# EAGLE design main1 (EAGLE 7.3.0)
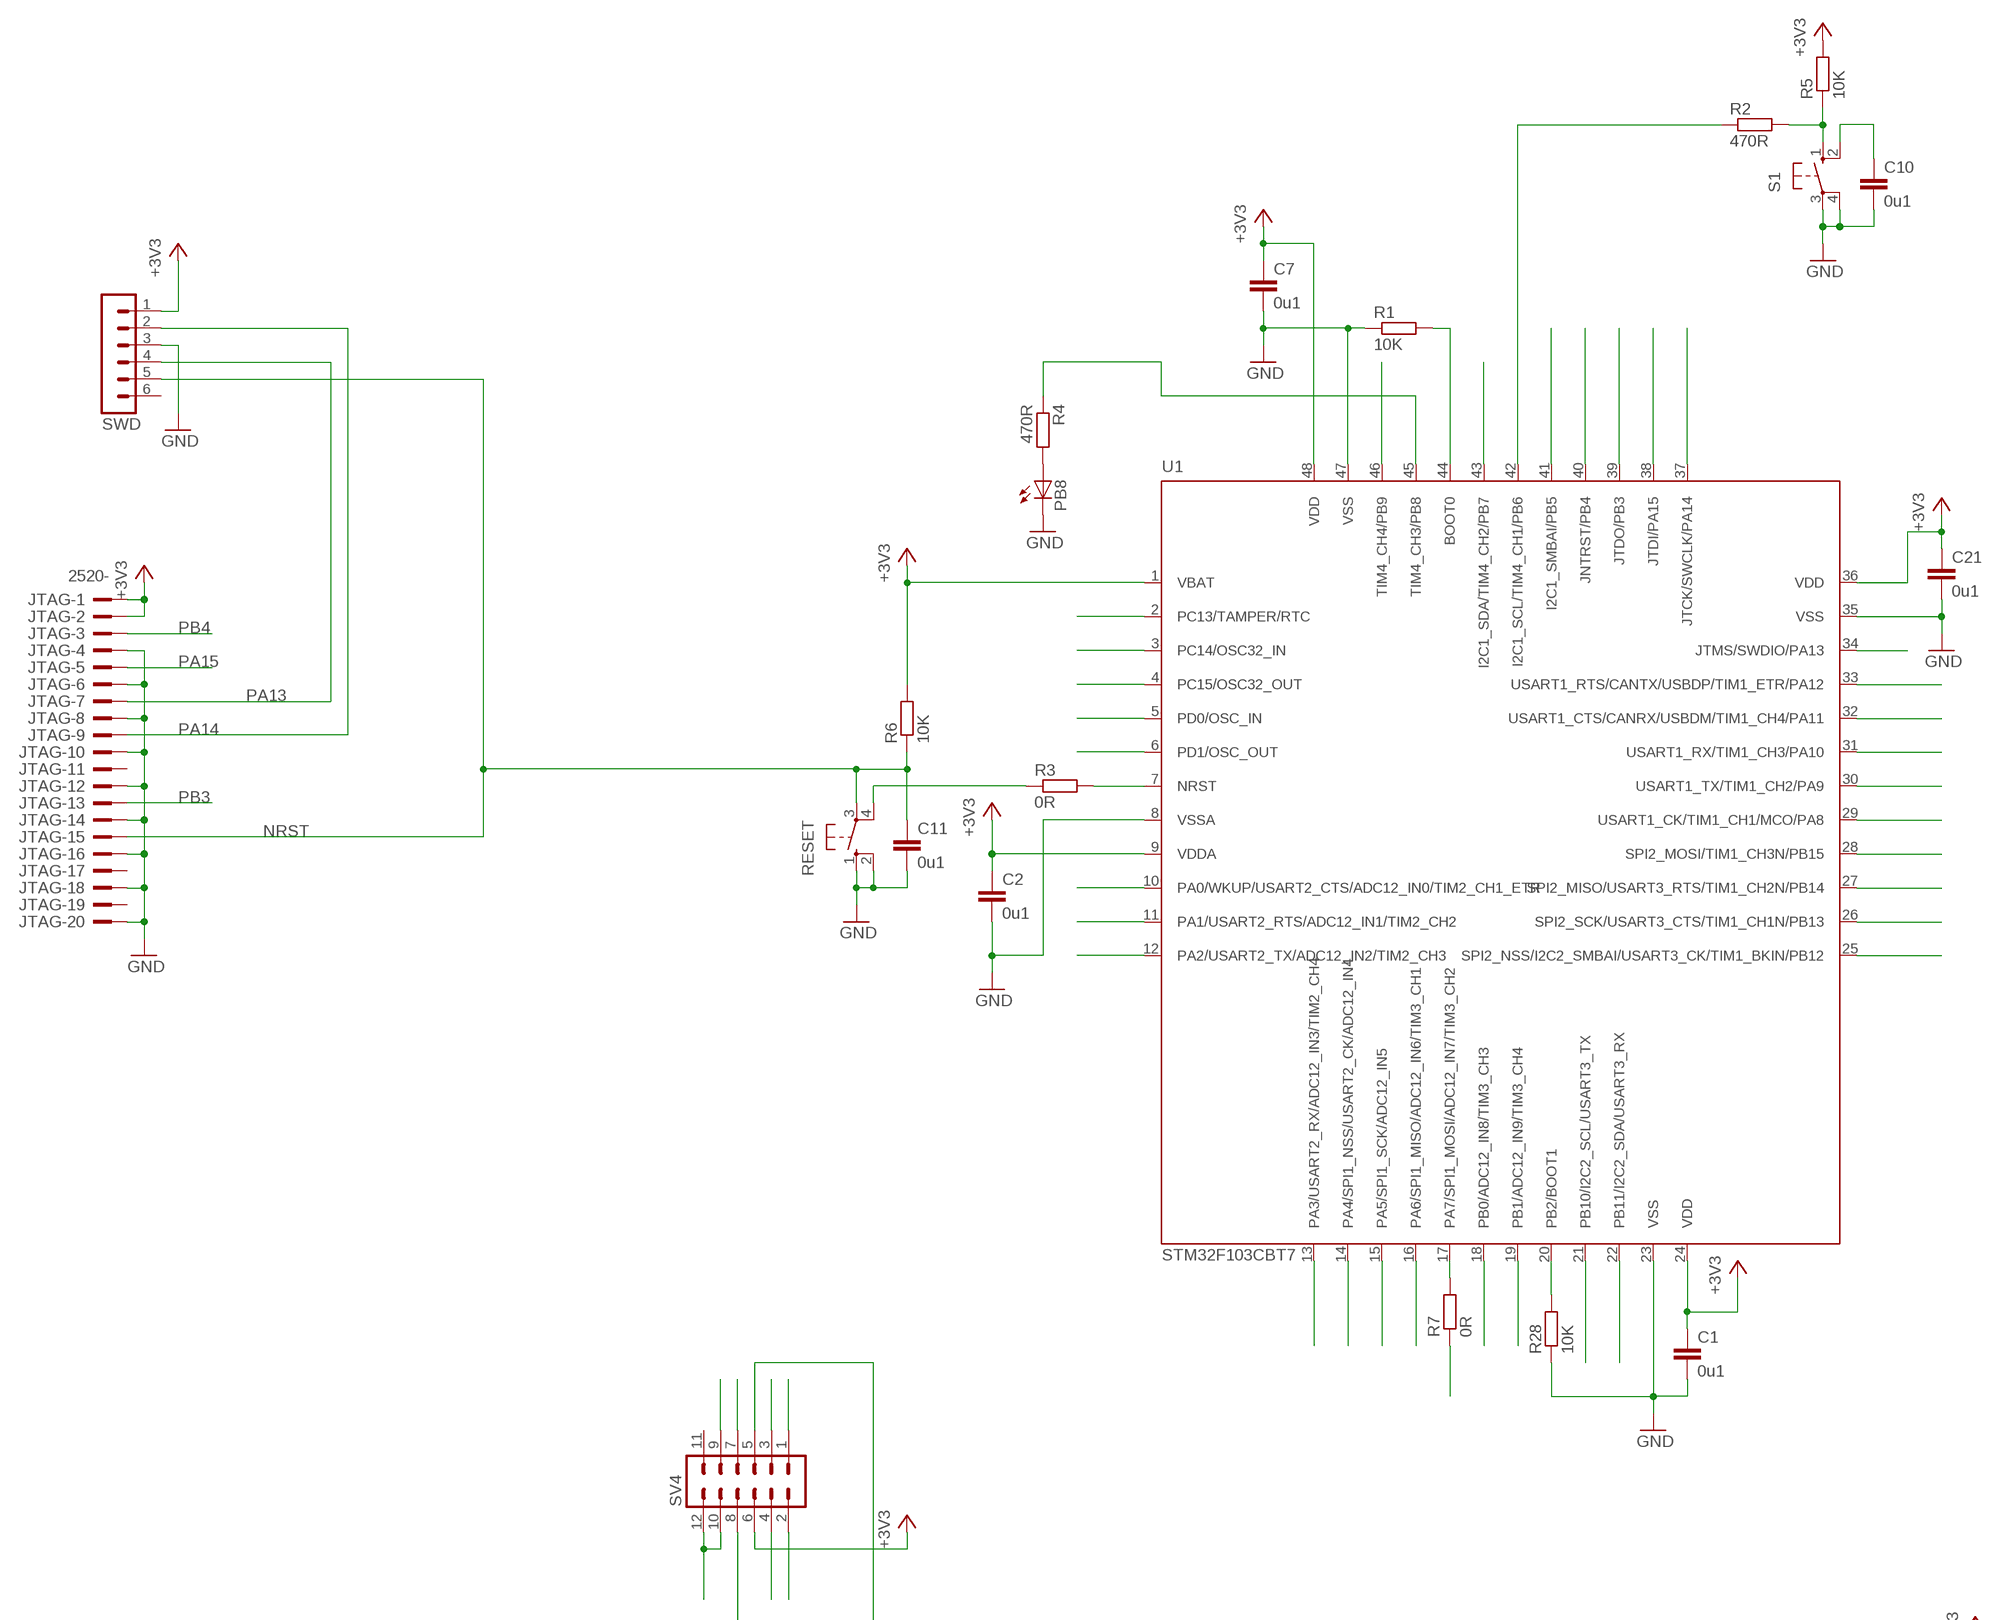
[diagram p0: schematic, sheet 1, part 1 of 2]
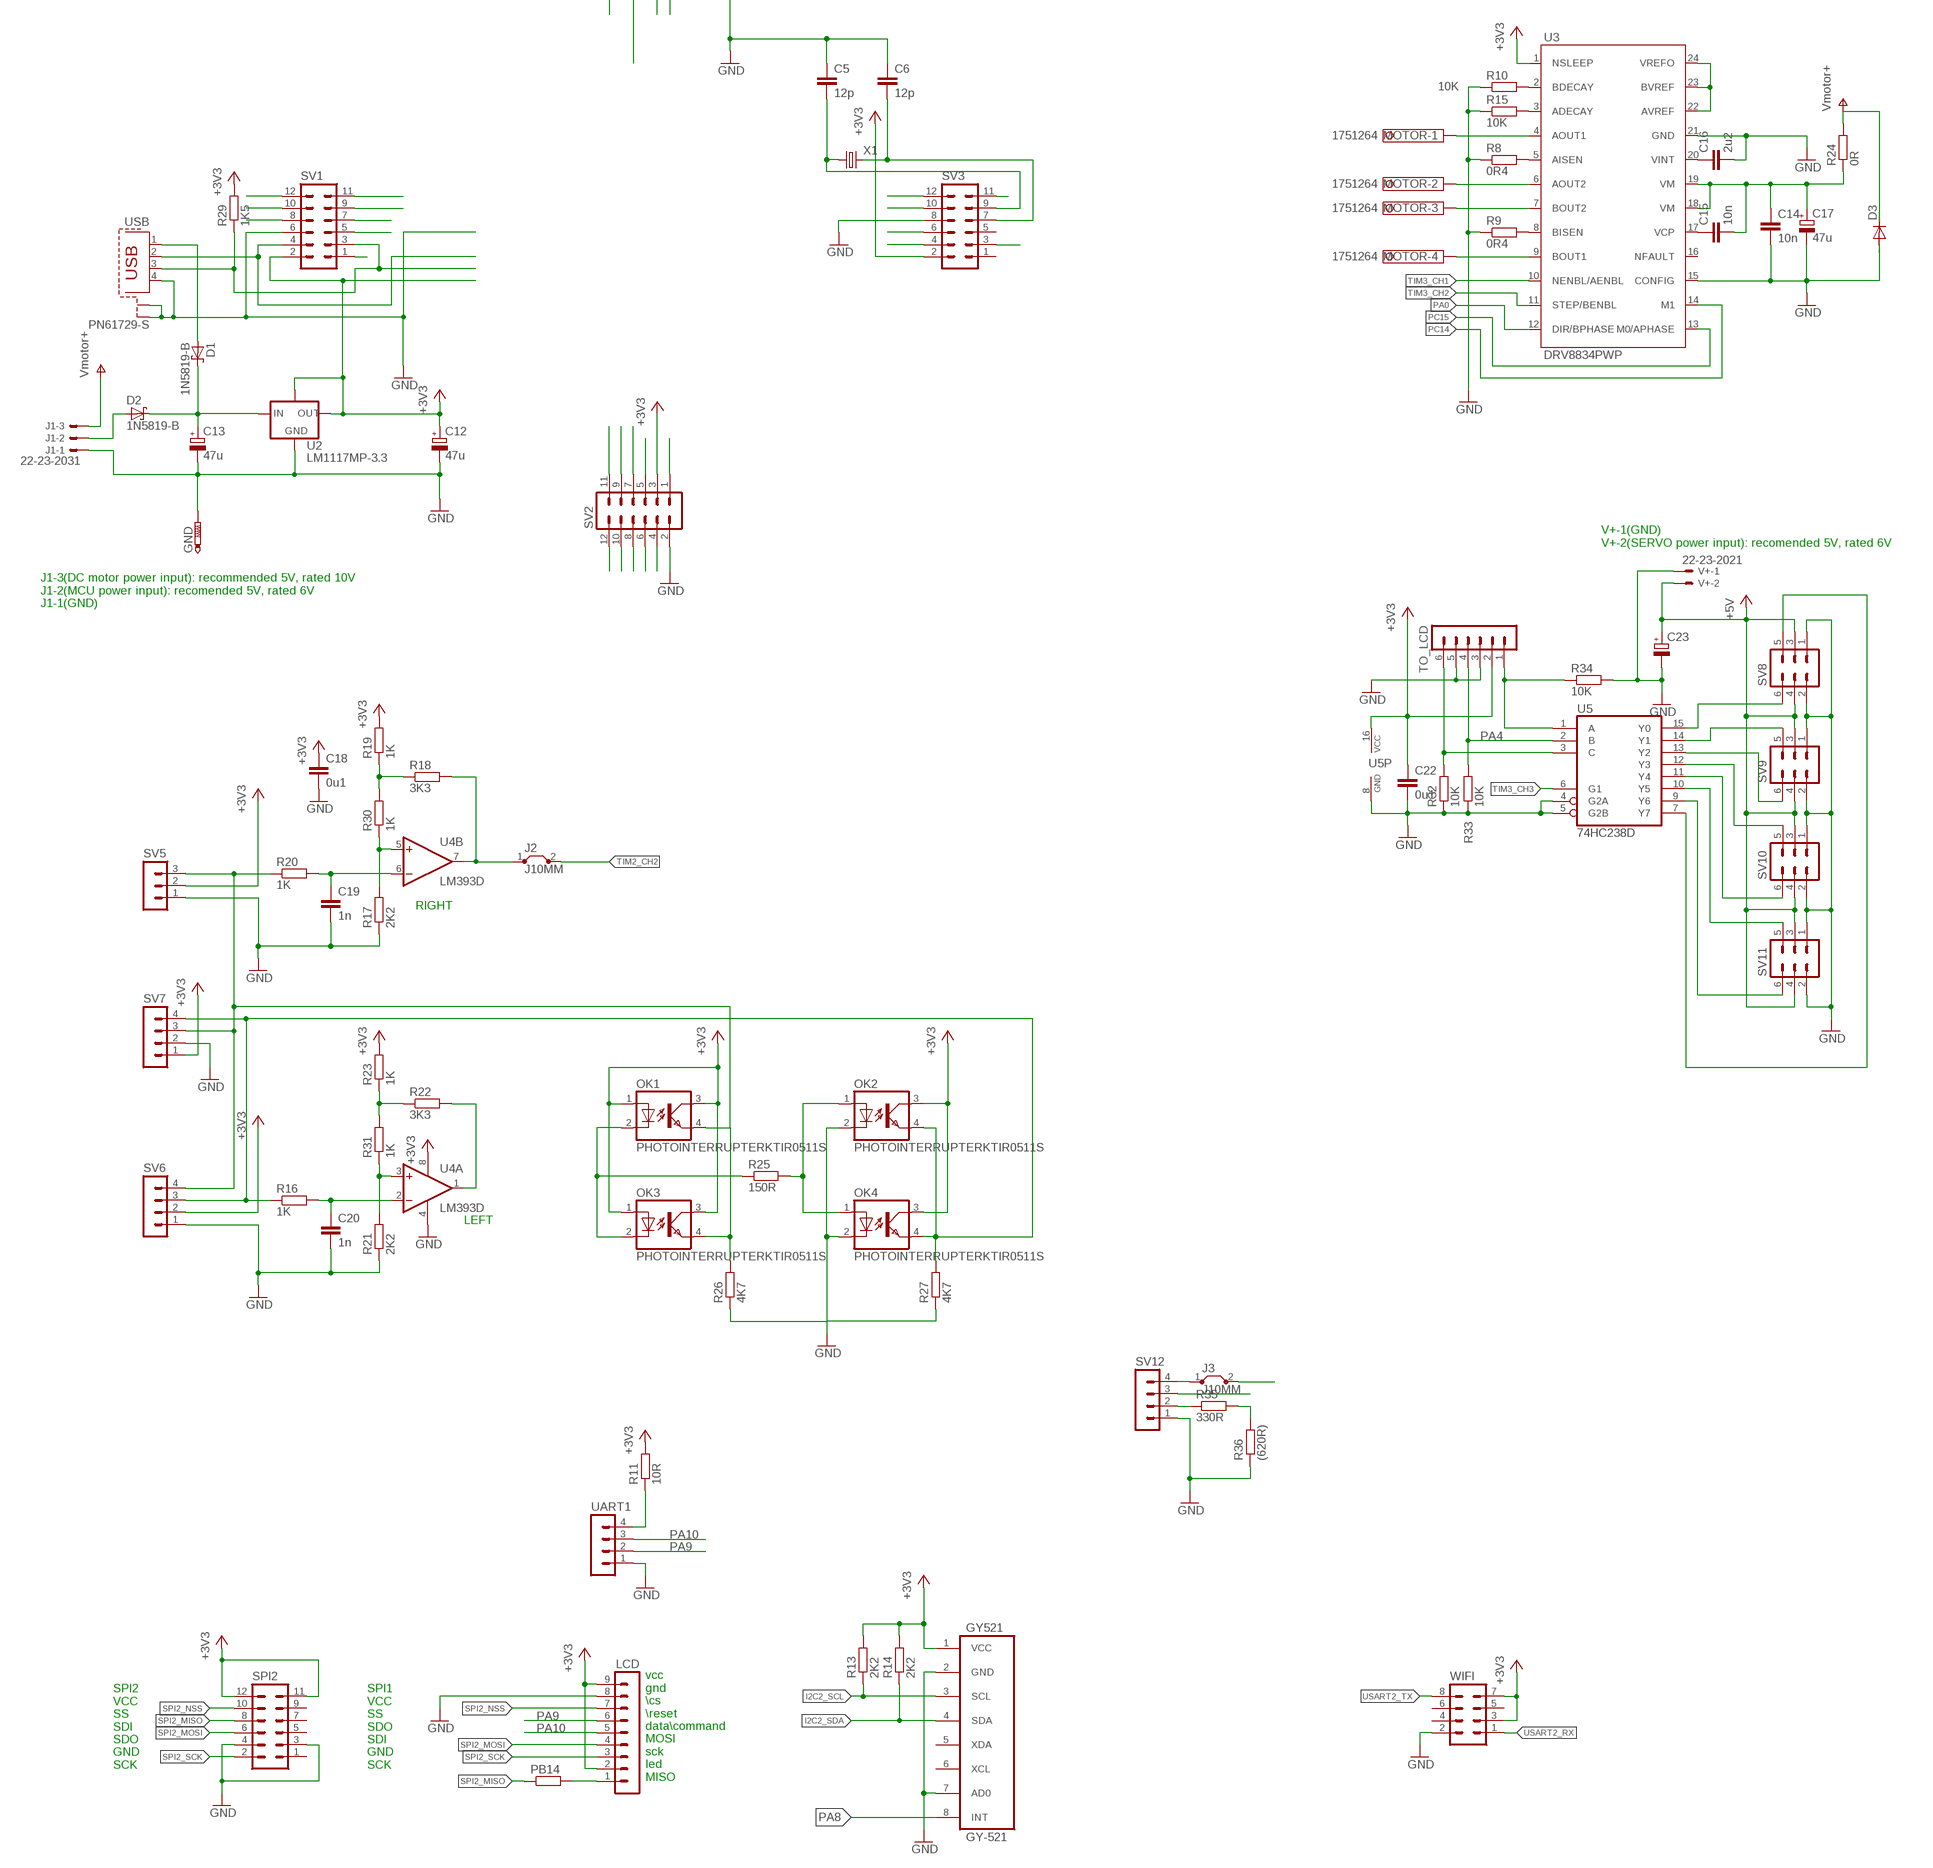
[diagram p1: schematic, sheet 1, part 2 of 2]

## Parts
C1  0u1  C-EUC0805  [C0805]
C2  0u1  C-EUC0805  [C0805]
C5  12p  C-EUC0805  [C0805]
C6  12p  C-EUC0805  [C0805]
C7  0u1  C-EUC0805  [C0805]
C10  0u1  C-EUC0805  [C0805]
C11  0u1  C-EUC0805  [C0805]
C12  47u  CPOL-EUE1.8-4  [E1,8-4]
C13  47u  CPOL-EUE1.8-4  [E1,8-4]
C14  10n  C-EUC0805  [C0805]
C15  10n  C-EUC0805  [C0805]
C16  2u2  C-EUC0805  [C0805]
C17  47u  CPOL-EUE1.8-4  [E1,8-4]
C18  0u1  C-EUC0805  [C0805]
C19  1n  C-EUC0805  [C0805]
C20  1n  C-EUC0805  [C0805]
C21  0u1  C-EUC0805  [C0805]
C22  0u1  C-EUC0805  [C0805]
C23  CPOL-EUE2.5-7  [E2,5-7]
D1  1N5819-B  [DO41-7.6]
D2  1N5819-B  [DO41-7.6]
D3  DIODE-SMB  [SMB]
GND  PTR1PAD1-13  [P1-13]
GY521  GY-521  [GY-521]
J1  22-23-2031  [22-23-2031]
J2  J10MM  [10]
J3  J10MM  [10]
JTAG  2520-  [PAK100/2500-20]
LCD  MA09-1  [MA09-1]
MOTOR  1751264  [1751264]
OK1  PHOTOINTERRUPTERKTIR0511S  [KTIR0511S]
OK2  PHOTOINTERRUPTERKTIR0511S  [KTIR0511S]
OK3  PHOTOINTERRUPTERKTIR0511S  [KTIR0511S]
OK4  PHOTOINTERRUPTERKTIR0511S  [KTIR0511S]
PB8  LED3MM  [LED3MM]
PB14  R-EU_0207/10  [0207/10]
R1  10K  R-EU_M0805  [M0805]
R2  470R  R-EU_0207/10  [0207/10]
R3  0R  R-EU_0207/10  [0207/10]
R4  470R  R-EU_0207/10  [0207/10]
R5  10K  R-EU_0207/10  [0207/10]
R6  10K  R-EU_M0805  [M0805]
R7  0R  R-EU_0207/10  [0207/10]
R8  0R4  R-EU_R2010  [R2010]
R9  0R4  R-EU_R2010  [R2010]
R10  10K  R-EU_R0805  [R0805]
R11  10R  R-EU_M0805  [M0805]
R13  2K2  R-EU_M0805  [M0805]
R14  2K2  R-EU_M0805  [M0805]
R15  10K  R-EU_R0805  [R0805]
R16  1K  R-EU_0207/10  [0207/10]
R17  2K2  R-EU_M0805  [M0805]
R18  3K3  R-EU_M0805  [M0805]
R19  1K  R-EU_M0805  [M0805]
R20  1K  R-EU_0207/10  [0207/10]
R21  2K2  R-EU_M0805  [M0805]
R22  3K3  R-EU_M0805  [M0805]
R23  1K  R-EU_M0805  [M0805]
R24  0R  R-EU_0207/10  [0207/10]
R25  150R  R-EU_0207/10  [0207/10]
R26  4K7  R-EU_M0805  [M0805]
R27  4K7  R-EU_M0805  [M0805]
R28  10K  R-EU_M0805  [M0805]
R29  1K5  R-EU_M0805  [M0805]
R30  1K  R-EU_M0805  [M0805]
R31  1K  R-EU_M0805  [M0805]
R32  10K  R-EU_M0805  [M0805]
R33  10K  R-EU_M0805  [M0805]
R34  10K  R-EU_M0805  [M0805]
R35  330R  R-EU_M0805  [M0805]
R36  (620R)  R-EU_M0805  [M0805]
RESET  10-XX  [B3F-10XX]
S1  10-XX  [B3F-10XX]
SPI2  MA06-2  [MA06-2]
SV1  MA06-2  [MA06-2]
SV2  MA06-2  [MA06-2]
SV3  MA06-2  [MA06-2]
SV4  MA06-2  [MA06-2]
SV5  MA03-1  [MA03-1]
SV6  MA04-1  [MA04-1]
SV7  MA04-1  [MA04-1]
SV8  MA03-2  [MA03-2]
SV9  MA03-2  [MA03-2]
SV10  MA03-2  [MA03-2]
SV11  MA03-2  [MA03-2]
SV12  MA04-1  [MA04-1]
SWD  MA06-1  [MA06-1]
TO_LCD  MA06-1  [MA06-1]
U1  STM32F103CBT7  [LQFP48-7X7]
U2  LM1117MP-3.3  LM1117  [SOT230P700X180-4N]
U3  DRV8834PWP  [PWP-TSSOP24]
U4  LM393D  [SO08]
U5  74HC238D  [SO16]
UART1  MA04-1  [MA04-1]
USB  PN61729-S  [PN61729-S]
V+  22-23-2021  [22-23-2021]
WIFI  MA04-2  [MA04-2]
X1  CRYSTALHC49S  [HC49/S]

## Nets
+3V3: C1.1 C2.1 C7.1 C12.+ C18.1 C21.1 C22.1 GY521.1(VCC) JTAG.1 JTAG.2 LCD.2 LCD.9 OK1.1(A) OK1.3(COL) OK2.3(COL) OK3.1(A) OK3.3(COL) OK4.3(COL) R5.2 R6.2 R11.2 R13.2 R14.2 R19.2 R23.2 R29.2 SPI2.11 SPI2.12 SV1.2 SV2.3 SV3.2 SV4.6 SV5.2 SV6.2 SV7.1 SWD.1 TO_LCD.2 U1.1(VBAT) U1.9(VDDA) U1.24(VDD) U1.36(VDD) U1.48(VDD) U2.2(OUT) U2.4(TAB) U3.1(NSLEEP) U4.8(P:V+) U5.16(VCC) WIFI.3 WIFI.7
+5V: C23.+ SV8.3 SV8.4 SV9.3 SV9.4 SV10.3 SV10.4 SV11.3 SV11.4 V+.2
BOOT0: R1.2 SV2.5 U1.44(BOOT0)
BOOT1: R28.2 SV4.8 U1.20(PB2/BOOT1)
GND: C1.2 C2.2 C5.1 C6.1 C7.2 C10.2 C11.2 C12.- C13.- C14.2 C16.2 C17.- C18.2 C19.2 C20.2 C21.2 C22.2 C23.- D3.A GND.TP GY521.2(GND) GY521.7(AD0) J1.1 JTAG.4 JTAG.6 JTAG.8 JTAG.10 JTAG.12 JTAG.14 JTAG.16 JTAG.18 JTAG.20 LCD.8 OK2.2(C) OK4.2(C) PB8.K(C) R1.1 R8.1 R9.1 R10.1 R15.1 R17.1 R21.1 R26.1 R27.1 R28.1 R32.1 R33.1 R34.2 R36.1 RESET.1(S) RESET.2(S1) S1.3(P) S1.4(P1) SPI2.3 SPI2.4 SV1.6 SV2.2 SV3.8 SV4.5 SV5.1 SV6.1 SV7.2 SV8.1 SV8.2 SV9.1 SV9.2 SV10.1 SV10.2 SV11.1 SV11.2 SV12.1 SWD.3 TO_LCD.3 TO_LCD.5 U1.8(VSSA) U1.23(VSS) U1.35(VSS) U1.47(VSS) U2.1(GND) U3.15(CONFIG) U3.21(GND) U4.4(P:V-) U5.4(G2A) U5.5(G2B) U5.8(GND) UART1.1 USB.4 USB.S1 USB.S2 V+.1 WIFI.2
I2C2_SCL: GY521.3(SCL) R13.1 SV4.9 U1.21(PB10/I2C2_SCL/USART3_TX)
I2C2_SDA: GY521.4(SDA) R14.1 SV4.10 SV4.12 U1.22(PB11/I2C2_SDA/USART3_RX)
N$1: OK1.4(EMIT) OK3.4(EMIT) R20.1 R26.2 SV5.3 SV6.4 SV7.3
N$2: D1.A USB.1
N$3: J3.1 SV12.4
N$4: R11.1 UART1.4
N$5: R3.2 U1.7(NRST)
N$6: OK1.2(C) OK3.2(C) R25.1
N$7: R18.1 R19.1 R30.2
N$8: R22.1 R23.1 R31.2
N$9: LCD.1 PB14.2
N$10: OK2.1(A) OK4.1(A) R25.2
N$11: R3.1 RESET.4(P1)
N$12: OK2.4(EMIT) OK4.4(EMIT) R16.1 R27.2 SV6.3 SV7.4
N$13: D2.A J1.2 J3.2
N$14: SV8.6 U5.15(Y0)
N$16: SV9.5 U5.14(Y1)
N$17: SV9.6 U5.13(Y2)
N$18: SV10.5 U5.12(Y3)
N$19: SV10.6 U5.11(Y4)
N$20: C19.1 R20.2 U4.6(B:-IN)
N$21: R2.2 R5.1 S1.1(S)
N$22: C10.1 S1.2(S1)
N$23: SV11.5 U5.10(Y5)
N$24: SV11.6 U5.9(Y6)
N$25: SV8.5 U5.7(Y7)
N$27: C13.+ D1.C D2.C U2.3(IN)
N$31: PB8.A R4.2
N$32: R7.2 U1.17(PA7/SPI1_MOSI/ADC12_IN7/TIM3_CH2)
N$33: R35.1 SV12.2
N$37: R8.2 U3.5(AISEN)
N$42: R9.2 U3.8(BISEN)
N$43: R10.2 U3.2(BDECAY)
N$46: R15.2 U3.3(ADECAY)
N$47: U3.22(AVREF) U3.23(BVREF) U3.24(VREFO)
N$48: C15.1 U3.17(VCP)
N$49: C16.1 U3.20(VINT)
N$51: R17.2 R30.1 U4.5(B:+IN)
N$52: C20.1 R16.2 U4.2(A:-IN)
N$53: R21.2 R31.1 U4.3(A:+IN)
N$54: C14.1 C15.2 C17.+ R24.1 U3.18(VM) U3.19(VM)
NRST: C11.1 JTAG.15 R6.1 RESET.3(P) SWD.5
PA0: SV3.10 U1.10(PA0/WKUP/USART2_CTS/ADC12_IN0/TIM2_CH1_ETR) U3.12(DIR/BPHASE)
PA4: R33.2 SV4.1 TO_LCD.4 U1.14(PA4/SPI1_NSS/USART2_CK/ADC12_IN4) U5.2(B)
PA5: SV4.2 U1.15(PA5/SPI1_SCK/ADC12_IN5)
PA8: GY521.8(INT) SV1.7 U1.29(USART1_CK/TIM1_CH1/MCO/PA8)
PA9: LCD.6 SV1.8 U1.30(USART1_TX/TIM1_CH2/PA9) UART1.2
PA10: LCD.5 SV1.5 U1.31(USART1_RX/TIM1_CH3/PA10) UART1.3
PA13: JTAG.7 SV1.1 SWD.4 U1.34(JTMS/SWDIO/PA13)
PA14: JTAG.9 SV2.12 SWD.2 U1.37(JTCK/SWCLK/PA14)
PA15: JTAG.5 SV2.11 U1.38(JTDI/PA15)
PB1: SV4.7 U1.19(PB1/ADC12_IN9/TIM3_CH4)
PB3: JTAG.13 SV2.10 U1.39(JTDO/PB3)
PB4: JTAG.3 R35.2 R36.2 SV2.9 U1.40(JNTRST/PB4)
PB5: SV2.8 SV12.3 U1.41(I2C1_SMBAI/PB5)
PB6: R2.1 SV2.7 U1.42(I2C1_SCL/TIM4_CH1/PB6)
PB7: R22.2 SV2.6 U1.43(I2C1_SDA/TIM4_CH2/PB7) U4.1(A:OUT)
PB8: R4.1 SV2.4 U1.45(TIM4_CH3/PB8)
PC13: SV3.4 U1.2(PC13/TAMPER/RTC)
PC14: SV3.3 U1.3(PC14/OSC32_IN) U3.14(M1)
PC15: SV3.6 U1.4(PC15/OSC32_OUT) U3.13(M0/APHASE)
PD0: C6.2 SV3.7 U1.5(PD0/OSC_IN) X1.2
PD1: C5.2 SV3.9 U1.6(PD1/OSC_OUT) X1.1
SPI2_MISO: PB14.1 SPI2.8 SV1.9 U1.27(SPI2_MISO/USART3_RTS/TIM1_CH2N/PB14)
SPI2_MOSI: LCD.4 SPI2.6 SV1.10 U1.28(SPI2_MOSI/TIM1_CH3N/PB15)
SPI2_NSS: LCD.7 SPI2.10 SV1.11 U1.25(SPI2_NSS/I2C2_SMBAI/USART3_CK/TIM1_BKIN/PB12)
SPI2_SCK: LCD.3 SPI2.2 SV1.12 U1.26(SPI2_SCK/USART3_CTS/TIM1_CH1N/PB13)
TIM2_CH2: J2.2 SV3.12 U1.11(PA1/USART2_RTS/ADC12_IN1/TIM2_CH2)
TIM2_CH2A: J2.1 R18.2 U4.7(B:OUT)
TIM3_CH1: SV4.3 U1.16(PA6/SPI1_MISO/ADC12_IN6/TIM3_CH1) U3.10(NENBL/AENBL)
TIM3_CH2: R7.1 SV3.11 U3.11(STEP/BENBL)
TIM3_CH3: SV4.4 U1.18(PB0/ADC12_IN8/TIM3_CH3) U5.6(G1)
TIM4_CH4: SV2.1 U1.46(TIM4_CH4/PB9)
U5A: R34.1 TO_LCD.1 U5.1(A)
U5C: R32.2 TO_LCD.6 U5.3(C)
USART2_RX: U1.13(PA3/USART2_RX/ADC12_IN3/TIM2_CH4) WIFI.1
USART2_TX: U1.12(PA2/USART2_TX/ADC12_IN2/TIM2_CH3) WIFI.8
USBDM: SV1.4 U1.32(USART1_CTS/CANRX/USBDM/TIM1_CH4/PA11) USB.2
USBDP: R29.1 SV1.3 U1.33(USART1_RTS/CANTX/USBDP/TIM1_ETR/PA12) USB.3
V+: D3.C J1.3 R24.2 ; supply symbol labelled Vmotor+
X21: MOTOR.4 U3.9(BOUT1)
X22: MOTOR.3 U3.7(BOUT2)
X23: MOTOR.2 U3.6(AOUT2)
X24: MOTOR.1 U3.4(AOUT1)
Unconnected: GY521.5(XDA) GY521.6(XCL) JTAG.11 JTAG.17 JTAG.19 SPI2.1 SPI2.5 SPI2.7 SPI2.9 SV3.1 SV3.5 SV4.11 SWD.6 U3.16(NFAULT) WIFI.4 WIFI.5 WIFI.6

## Notes on the sheet
- V+-1(GND)
  V+-2(SERVO power input): recomended 5V, rated 6V
- J1-3(DC motor power input): recommended 5V, rated 10V
  J1-2(MCU power input): recomended 5V, rated 6V
  J1-1(GND)
- RIGHT
- LEFT
- SPI2
  VCC
  SS
  SDI
  SDO
  GND
  SCK
- SPI1
  VCC
  SS
  SDO
  SDI
  GND
  SCK
- vcc
  gnd
  \cs
  \reset
  data\command
  MOSI
  sck
  led
  MISO

## Power pins joined to a net without a drawn wire
GND: U3.EXP(GND)

## Library data of the parts
C1 C2 C5-C7 C10 C11 C14-C16 C18-C22 = rcl:C-EU: CAPACITOR, European symbol
C12 C13 C17 C23 = rcl:CPOL-EU: POLARIZED CAPACITOR, European symbol
D1 D2 = diode:1N581*: 1.0A SCHOTTKY BARRIER RECTIFIER Source: http://www.diodes.com/datasheets/ds23001.pdf
D3 = diode:DIODE-: DIODE
GND = testpad:PTR1: TEST PIN
GY521 = ensylam:GY-521: MPU6050, accelerometer and gyroscope
J1 = con-molex:22-23-2031: .100" (2.54mm) Center Header - 3 Pin; MF: MOLEX; MPN: 22-23-2031; OC_FARNELL: 1462950; OC_NEWARK: 30C0862
J2 J3 = jumper:J: Bridge
JTAG = con-3m:2520-: 3M (TM) Pak 100 4-Wall Header Source: 3M; OC_FARNELL: unknown; OC_NEWARK: unknown
LCD = ensylam:MA09-1: PIN HEADER; OC_FARNELL: unknown; OC_NEWARK: unknown
MOTOR = con-phoenix-350:1751264: MKDS 1/ 4-3,5 Printklemme Nennstrom: 10 A Bemessungsspannung: 160 V Raster: 3,5 mm Polzahl: 4 Montageart: Löten Anschlussart: Schraubanschluss Anschlussrichtung vom Leiter zur Platine: 0° Source: http://eshop.phoenixcontact.com .. 1751264.pdf; MPN: 1751264; OC_FARNELL: unknown; OC_NEWARK: 10R0934
OK1-OK4 = ensylam:PHOTOINTERRUPTER: Opto Interrupter
PB8 = led:LED: LED OSRAM: - CHIPLED LG R971, LG N971, LY N971, LG Q971, LY Q971, LO R971, LY R971 LH N974, LH R974 LS Q976, LO Q976, LY Q976 LO Q996 - Hyper CHIPLED LW Q18S LB Q993, LB Q99A, LB R99A - SideLED LS A670, LO A670, LY A670, LG A670, LP A670 LB A673, LV A673, LT A673, LW A673 LH A674 LY A675 LS A676, LA A676, LO A676, LY A676, LW A676 LS A679, LY A679, LG A679 - Hyper Micro SIDELED® LS Y876, LA Y876, LO Y876, LY Y876 LT Y87S - SmartLED LW L88C, LW L88S LB L89C, LB L89S, LG L890 LS L89K, LO L89K, LY L89K LS L896, LA L896, LO L896, LY L896 - TOPLED LS T670, LO T670, LY T670, LG T670, LP T670 LSG T670, LSP T670, LSY T670, LOP T670, LYG T670 LG T671, LOG T671, LSG T671 LB T673, LV T673, LT T673, LW T673 LH T674 LS T676, LA T676, LO T676, LY T676, LB T676, LH T676, LSB T676, LW T676 LB T67C, LV T67C, LT T67C, LS T67K, LO T67K, LY T67K, LW E67C LS E67B, LA E67B, LO E67B, LY E67B, LB E67C, LV E67C, LT E67C LW T67C LS T679, LY T679, LG T679 LS T770, LO T770, LY T770, LG T770, LP T770 LB T773, LV T773, LT T773, LW T773 LH T774 LS E675, LA E675, LY E675, LS T675 LS T776, LA T776, LO T776, LY T776, LB T776 LHGB T686 LT T68C, LB T68C - Hyper Mini TOPLED® LB M676 - Mini TOPLED Santana® LG M470 LS M47K, LO M47K, LY M47K Source: http://www.osram.convergy.de LUXEON: - LUMILED® LXK2-PW12-R00, LXK2-PW12-S00, LXK2-PW14-U00, LXK2-PW14-V00 LXK2-PM12-R00, LXK2-PM12-S00, LXK2-PM14-U00 LXK2-PE12-Q00, LXK2-PE12-R00, LXK2-PE12-S00, LXK2-PE14-T00, LXK2-PE14-U00 LXK2-PB12-K00, LXK2-PB12-L00, LXK2-PB12-M00, LXK2-PB14-N00, LXK2-PB14-P00, LXK2-PB14-Q00 LXK2-PR12-L00, LXK2-PR12-M00, LXK2-PR14-Q00, LXK2-PR14-R00 LXK2-PD12-Q00, LXK2-PD12-R00, LXK2-PD12-S00 LXK2-PH12-R00, LXK2-PH12-S00 LXK2-PL12-P00, LXK2-PL12-Q00, LXK2-PL12-R00 Source: www.luxeon.com KINGBRIGHT: KA-3528ASYC Source: www.kingbright.com
PB14 R1-R11 R13-R36 = rcl:R-EU_: RESISTOR, European symbol
RESET S1 = switch-omron:10-XX: OMRON SWITCH; MPN: B3F-1000; OC_FARNELL: 176432; OC_NEWARK: 36M3542
SPI2 SV1-SV4 = con-lstb:MA06-2: PIN HEADER; OC_FARNELL: unknown; OC_NEWARK: unknown
SV5 = con-lstb:MA03-1: PIN HEADER; OC_FARNELL: unknown; OC_NEWARK: unknown
SV6 SV7 SV12 UART1 = con-lstb:MA04-1: PIN HEADER; OC_FARNELL: unknown; OC_NEWARK: unknown
SV8-SV11 = con-lstb:MA03-2: PIN HEADER; OC_FARNELL: unknown; OC_NEWARK: unknown
SWD TO_LCD = con-lstb:MA06-1: PIN HEADER; OC_FARNELL: unknown; OC_NEWARK: unknown
U1 = ensylam:STM32F103CBT7: Medium-density performance lin e ARM-based 32-bit MCUwith 64 or 128 KB Flash, USB, CAN, 7 timers, 2 ADCs, 9 com. interfaces Source:http://www.farnell.com/datasheets/1730126.pdf
U2 = ensylam:LM1117: VOLTAGE REGULATOR
U3 = ensylam:DRV8834: DUAL BRIDGE STEPPER OR DC MOTOR DRIVER; ELEMENT14: 2115234
U4 = linear:LM393: COMPARATOR
U5 = ensylam:74*238: 3-line to 8-line DECODER/DEMULTIPLEXER
USB = con-berg:PN61729-S: BERG USB connector; OC_FARNELL: unknown; OC_NEWARK: unknown
V+ = con-molex:22-23-2021: .100" (2.54mm) Center Header - 2 Pin; MF: MOLEX; MPN: 22-23-2021; OC_FARNELL: 1462926; OC_NEWARK: 25C3832
WIFI = con-lstb:MA04-2: PIN HEADER; OC_FARNELL: unknown; OC_NEWARK: unknown
X1 = crystal:CRYSTAL: CRYSTAL; OC_FARNELL: 1667008; OC_NEWARK: unknown

## Board
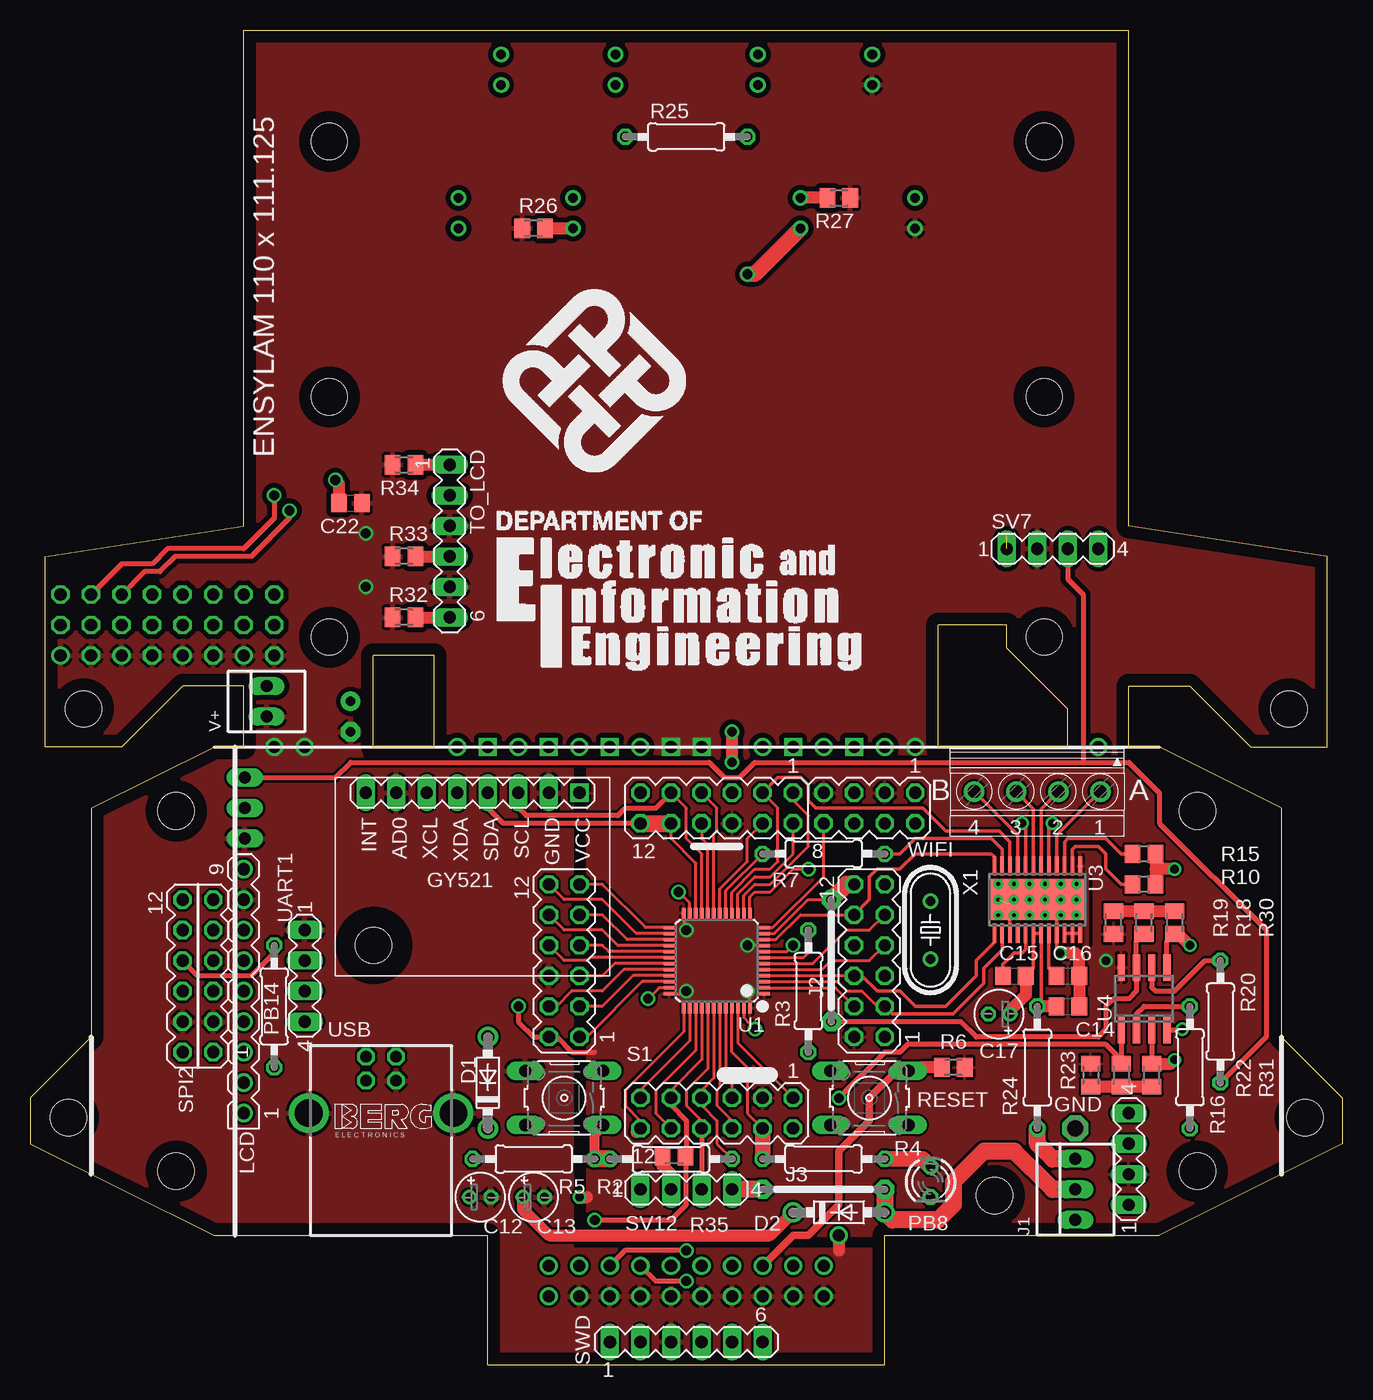
[diagram p2: board, top side]
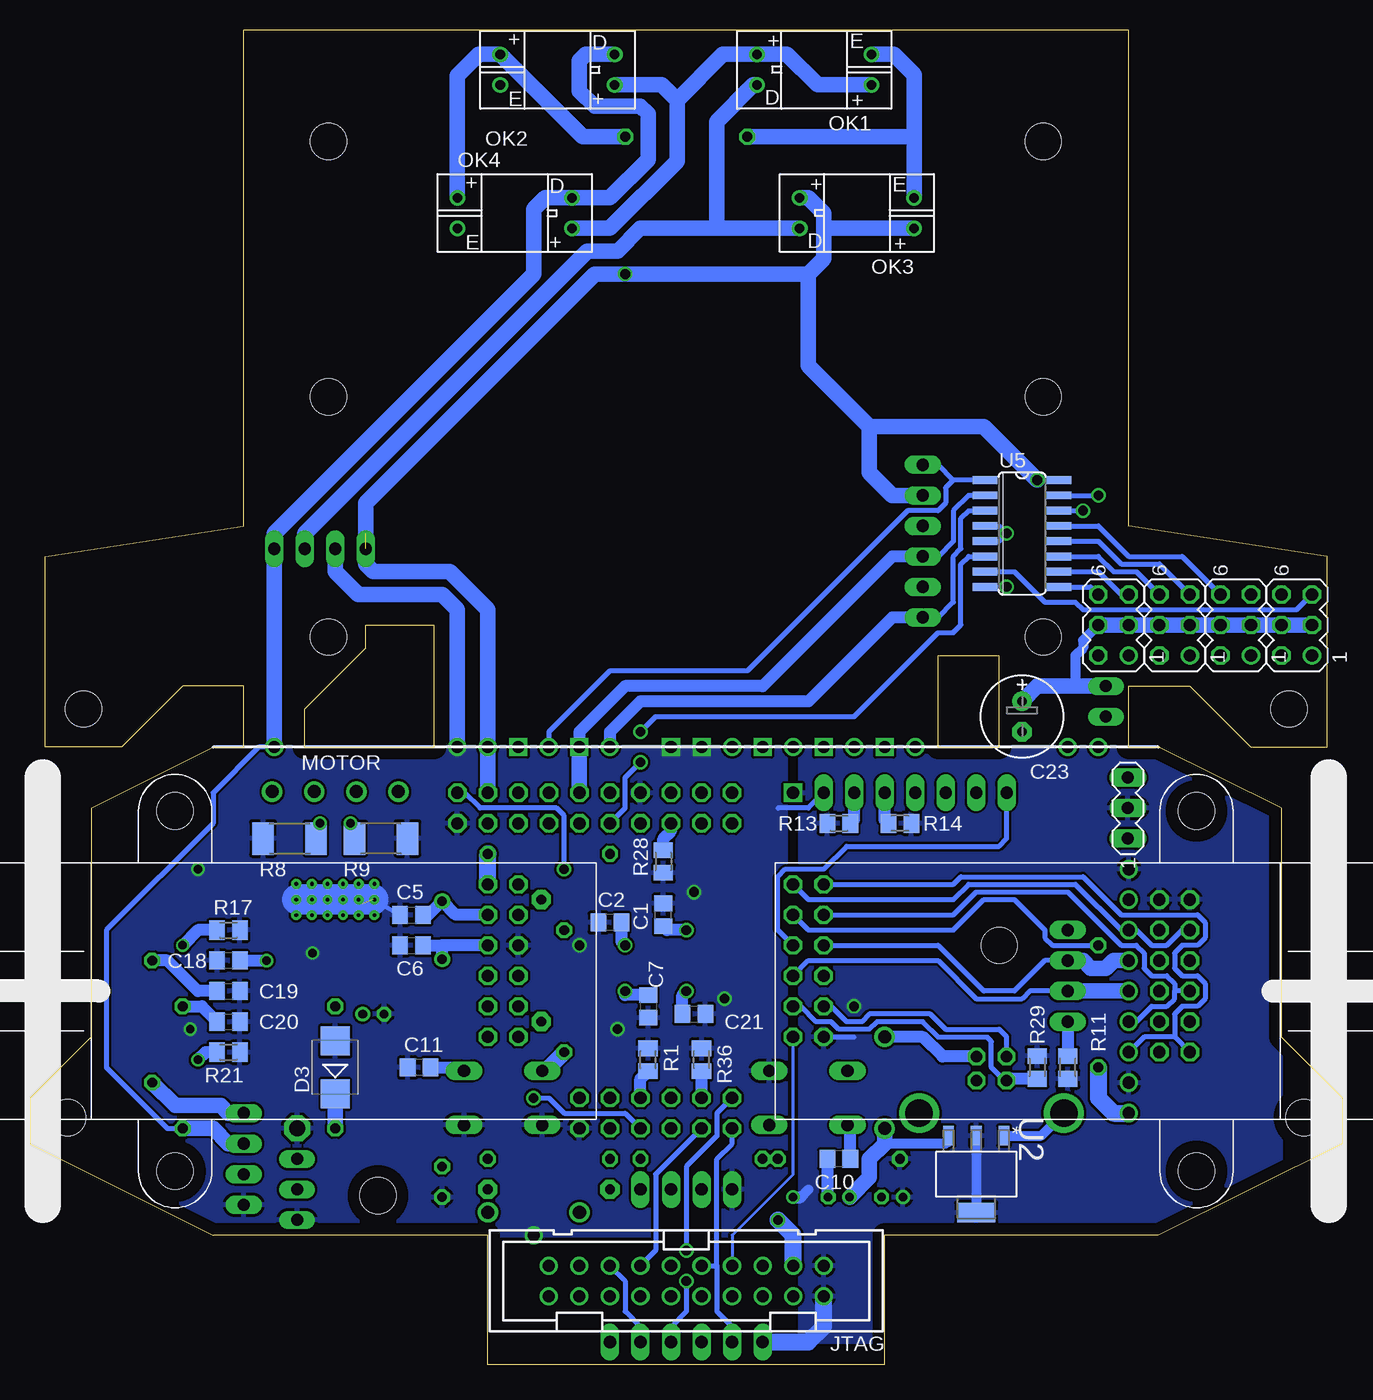
[diagram p3: board, bottom side, seen from below]

Size 109.22 x 111.12 mm. Coordinates in mm from the lower left corner, seen from the top.
Outline: 15.32,10.79 38.1,10.79 38.1,0 71.12,0 71.12,10.79 93.98,10.79 109.22,18.41 109.22,22.23 104.14,27.3 104.14,46.36 93.98,51.44 91.44,51.44 91.44,56.52 96.52,56.52 101.6,51.44 107.95,51.44 107.95,67.31 91.44,69.85 91.44,111.12 17.78,111.12 17.78,69.85 1.27,67.31 1.27,51.44 7.62,51.44 12.7,56.52 17.78,56.52 17.78,51.44 15.32,51.44 5.08,46.36 5.08,27.3 0,22.23 0,18.41 15.32,10.79
Outline: 86.36,51.44 75.56,51.44 75.56,61.59 81.28,61.59 81.28,59.69 86.36,54.61 86.36,51.44
Outline: 28.57,51.44 28.57,59.05 33.66,59.05 33.66,51.44 28.57,51.44
Copper layers (1*16): Top 0.035mm / dielectric 1.5mm / Bottom 0.035mm
Design rules "default": minimum track width 10mil, minimum drill 24mil, track to track 8mil, track to pad 8mil, pad to pad 8mil, via to via 8mil, smd to smd 8mil, copper to edge 40mil, drill to drill 8mil, minimum pad ring 10mil, minimum via ring 8mil, stop-mask expansion 4mil, vias tented up to drill 0mil, thermal gap 10mil
Holes 3 mm at 28.57,34.92 80.26,14.1 24.91,101.85 84.39,101.85 24.91,80.58 84.39,80.58 24.91,60.58 84.39,60.58 106.09,20.58 3.21,20.58 4.45,54.61 104.78,54.61
tRestrict: area 73.7,37.5 to 76.2,40; area 73.7,32.4 to 76.2,34.9; area 25.6,31.9 to 31.6,37.9; 2 lines
bRestrict: area 25.6,31.9 to 31.6,37.9

### Footprints (pad centres in the part's own frame; a part is rotated, then mirrored left to right if it is on the bottom)
C0805 = smd 1.3 x 1.5: 1 -0.95,0; 2 0.95,0
E1,8-4 = drill 0.711 pad 1.168: + -0.889,0 | drill 0.711 pad 1.168 octagon: - 0.889,0
E2,5-7 = drill 0.813 pad 1.6: + -1.27,0 | drill 0.813 pad 1.6 octagon: - 1.27,0
DO41-7.6 = drill 1.1 pad 1.7: A 3.81,0; C -3.81,0
SMB = smd 2.4 x 2.4: A 2.2,0; C -2.2,0
P1-13 = drill 1.321 pad 2.159 octagon: TP 0,0
GY-521 = drill 1.016 square: 1 -8.89,0 | drill 1.016 long: 2 -6.35,0; 3 -3.81,0; 4 -1.27,0; 5 1.27,0; 6 3.81,0; 7 6.35,0; 8 8.89,0
22-23-2031 = drill 1 long: 1 -2.54,0; 2 0,0; 3 2.54,0
10 = drill 0.813 pad 1.6 octagon: 1 -5.08,0; 2 5.08,0
PAK100/2500-20 = drill 1 pad 1.422: 1 -11.43,-1.27; 2 -11.43,1.27; 3 -8.89,-1.27; 4 -8.89,1.27; 5 -6.35,-1.27; 6 -6.35,1.27; 7 -3.81,-1.27; 8 -3.81,1.27; 9 -1.27,-1.27; 10 -1.27,1.27; 11 1.27,-1.27; 12 1.27,1.27; 13 3.81,-1.27; 14 3.81,1.27; 15 6.35,-1.27; 16 6.35,1.27; 17 8.89,-1.27; 18 8.89,1.27; 19 11.43,-1.27; 20 11.43,1.27
MA09-1 = drill 1.016: 1 -10.16,0; 2 -7.62,0; 3 -5.08,0; 4 -2.54,0; 5 0,0; 6 2.54,0; 7 5.08,0; 8 7.62,0; 9 10.16,0
1751264 = drill 1.1 pad 1.7: 1 -5.25,-0.1; 2 -1.75,-0.1; 3 1.75,-0.1; 4 5.25,-0.1
KTIR0511S = drill 0.8: 1 -5.715,1.27; 2 -5.715,-1.27; 3 3.81,-1.27; 4 3.81,1.27
LED3MM = drill 0.813 octagon: A -1.27,0; K 1.27,0
0207/10 = drill 0.813 octagon: 1 -5.08,0; 2 5.08,0
M0805 = smd 1.3 x 1.6: 1 -0.95,0; 2 0.95,0
R2010 = smd 1.8 x 2.7: 1 -2.2,0; 2 2.2,0
R0805 = smd 1.3 x 1.5: 1 -0.95,0; 2 0.95,0
B3F-10XX = drill 1.016 long: 1 -3.251,2.261; 2 3.251,2.261; 3 -3.251,-2.261; 4 3.251,-2.261
MA06-2 = drill 1.016 octagon: 1 -6.35,-1.27; 2 -6.35,1.27; 3 -3.81,-1.27; 4 -3.81,1.27; 5 -1.27,-1.27; 6 -1.27,1.27; 7 1.27,-1.27; 8 1.27,1.27; 9 3.81,-1.27; 10 3.81,1.27; 11 6.35,-1.27; 12 6.35,1.27
MA03-1 = drill 1.016 long: 1 -2.54,0; 2 0,0; 3 2.54,0
MA04-1 = drill 1.016 long: 1 -3.81,0; 2 -1.27,0; 3 1.27,0; 4 3.81,0
MA03-2 = drill 1.016: 1 -2.54,-1.27 | drill 1.016 octagon: 2 -2.54,1.27; 3 0,-1.27; 4 0,1.27; 5 2.54,-1.27; 6 2.54,1.27
MA06-1 = drill 1.016 long: 1 -6.35,0; 2 -3.81,0; 3 -1.27,0; 4 1.27,0; 5 3.81,0; 6 6.35,0
LQFP48-7X7 = smd 0.9 x 0.3: 1 -3.95,2.75; 2 -3.95,2.25; 3 -3.95,1.75; 4 -3.95,1.25; 5 -3.95,0.75; 6 -3.95,0.25; 7 -3.95,-0.25; 8 -3.95,-0.75; 9 -3.95,-1.25; 10 -3.95,-1.75; 11 -3.95,-2.25; 12 -3.95,-2.75; 25 3.95,-2.75; 26 3.95,-2.25; 27 3.95,-1.75; 28 3.95,-1.25; 29 3.95,-0.75; 30 3.95,-0.25; 31 3.95,0.25; 32 3.95,0.75; 33 3.95,1.25; 34 3.95,1.75; 35 3.95,2.25; 36 3.95,2.75 | smd 0.3 x 0.9: 13 -2.75,-3.95; 14 -2.25,-3.95; 15 -1.75,-3.95; 16 -1.25,-3.95; 17 -0.75,-3.95; 18 -0.25,-3.95; 19 0.25,-3.95; 20 0.75,-3.95; 21 1.25,-3.95; 22 1.75,-3.95; 23 2.25,-3.95; 24 2.75,-3.95; 37 2.75,3.95; 38 2.25,3.95; 39 1.75,3.95; 40 1.25,3.95; 41 0.75,3.95; 42 0.25,3.95; 43 -0.25,3.95; 44 -0.75,3.95; 45 -1.25,3.95; 46 -1.75,3.95; 47 -2.25,3.95; 48 -2.75,3.95
SOT230P700X180-4N = smd 1.626 x 0.889: 1 -3.2,2.311; 2 -3.2,0; 3 -3.2,-2.311 | smd 1.626 x 3.175: 4 3.2,0
PWP-TSSOP24 = smd 1.6 x 0.3: 1 -2.8,3.575; 2 -2.8,2.925; 3 -2.8,2.275; 4 -2.8,1.625; 5 -2.8,0.975; 6 -2.8,0.325; 7 -2.8,-0.325; 8 -2.8,-0.975; 9 -2.8,-1.625; 10 -2.8,-2.275; 11 -2.8,-2.925; 12 -2.8,-3.575; 13 2.8,-3.575; 14 2.8,-2.925; 15 2.8,-2.275; 16 2.8,-1.625; 17 2.8,-0.975; 18 2.8,-0.325; 19 2.8,0.325; 20 2.8,0.975; 21 2.8,1.625; 22 2.8,2.275; 23 2.8,2.925; 24 2.8,3.575 | smd 3.4 x 7.8: EXP 0,0 | drill 0.3 pad 0.7: EXP@1 -1.3,3.25; EXP@2 0,3.25; EXP@3 1.3,3.25; EXP@4 -1.3,1.95; EXP@5 0,1.95; EXP@6 1.3,1.95; EXP@7 -1.3,0.65; EXP@8 0,0.65; EXP@9 1.3,0.65; EXP@10 -1.3,-0.65; EXP@11 0,-0.65; EXP@12 1.3,-0.65; EXP@13 -1.3,-1.95; EXP@14 0,-1.95; EXP@15 1.3,-1.95; EXP@16 -1.3,-3.25; EXP@17 0,-3.25; EXP@18 1.3,-3.25
SO08 = smd 0.6 x 2.2: 1 -1.905,-2.6; 2 -0.635,-2.6; 3 0.635,-2.6; 4 1.905,-2.6; 5 1.905,2.6; 6 0.635,2.6; 7 -0.635,2.6; 8 -1.905,2.6
SO16 = smd 0.66 x 2.032: 1 -4.445,-3.073; 2 -3.175,-3.073; 3 -1.905,-3.073; 4 -0.635,-3.073; 5 0.635,-3.073; 6 1.905,-3.073; 7 3.175,-3.073; 8 4.445,-3.073; 9 4.445,3.073; 10 3.175,3.073; 11 1.905,3.073; 12 0.635,3.073; 13 -0.635,3.073; 14 -1.905,3.073; 15 -3.175,3.073; 16 -4.445,3.073
70103 = hole 3.048: -14.986,0; 14.986,0
PN61729-S = drill 0.95 octagon: 1 1.25,4.71; 2 -1.25,4.71; 3 -1.25,2.71; 4 1.25,2.71 | drill 2.3 pad 2.9: S1 -6.02,0; S2 6.02,0
22-23-2021 = drill 1 long: 1 -1.27,0; 2 1.27,0
MA04-2 = drill 1.016 octagon: 1 -3.81,-1.27; 2 -3.81,1.27; 3 -1.27,-1.27; 4 -1.27,1.27; 5 1.27,-1.27; 6 1.27,1.27; 7 3.81,-1.27; 8 3.81,1.27
HC49/S = drill 0.813: 1 -2.413,0; 2 2.413,0

### Placement (x,y rotation side)
C1  56.52,37.47 90 bottom
C2  60.96,36.83 180 bottom
C5  77.47,37.47 0 bottom
C6  77.47,34.92 0 bottom
C7  57.78,29.84 270 bottom
C10  41.91,17.14 180 bottom
C11  76.83,24.77 180 bottom
C12  37.47,13.97 0 top
C13  41.91,13.97 0 top
C14  86.36,29.84 0 top
C15  81.92,32.38 0 top
C16  86.36,32.38 0 top
C17  80.64,29.21 180 top
C18  92.71,33.66 180 bottom
C19  92.71,31.12 0 bottom
C20  92.71,28.58 0 bottom
C21  53.98,29.21 0 bottom
C22  26.67,71.75 0 top
C23  26.67,53.98 270 bottom
D1  38.1,23.49 90 top
D2  67.31,12.7 0 top
D3  83.82,24.77 90 bottom
GND  87,19.69 0 top
GY521  36.83,47.62 180 top
J1  87,14.61 90 top
J2  66.67,33.66 90 top
J3  66.04,14.61 0 top
JTAG  54.61,6.98 180 bottom
LCD  17.78,31.12 90 top
MOTOR  83.82,47.62 180 top
OK1  44.92,107.82 180 bottom
OK2  64.38,107.82 0 bottom
OK3  41.36,95.89 180 bottom
OK4  67.93,95.89 0 bottom
PB8  74.93,15.24 270 top
PB14  20.32,29.84 270 top
R1  57.78,25.4 270 bottom
R2  53.34,17.14 180 top
R3  64.77,31.12 90 top
R4  66.04,17.14 0 top
R5  41.91,17.14 180 top
R6  76.83,24.77 0 top
R7  66.04,42.55 180 top
R8  87.63,43.82 0 bottom
R9  80.01,43.82 180 bottom
R10  92.71,40.01 180 top
R11  22.86,24.77 270 bottom
R13  41.91,45.09 180 bottom
R14  36.83,45.09 0 bottom
R15  92.71,42.55 180 top
R16  96.52,24.77 90 top
R17  92.71,36.2 180 bottom
R18  92.71,36.83 270 top
R19  90.17,36.83 270 top
R20  99.06,28.58 90 top
R21  92.71,26.04 180 bottom
R22  90.81,24.13 90 top
R23  88.27,24.13 90 top
R24  83.82,24.77 270 top
R25  54.61,102.23 0 top
R26  41.91,94.61 0 top
R27  67.31,97.16 180 top
R28  56.52,41.91 90 bottom
R29  25.4,24.77 90 bottom
R30  95.25,36.83 90 top
R31  93.34,24.13 270 top
R32  31.11,62.23 0 top
R33  31.11,67.31 0 top
R34  31.11,74.93 180 top
R35  53.59,17.4 0 top
R36  53.34,25.4 270 bottom
RESET  69.85,22.23 180 top
S1  44.45,22.23 180 top
SPI2  13.97,32.38 90 top
SV1  44.45,33.66 90 top
SV2  57.15,20.95 180 top
SV3  69.85,33.66 90 top
SV4  57.15,46.36 180 top
SV5  17.86,46.36 90 bottom
SV6  91.44,17.14 90 top
SV7  85.09,67.94 0 top
SV8  3.81,61.59 90 bottom
SV9  8.89,61.59 90 bottom
SV10  13.97,61.59 90 bottom
SV11  19.05,61.59 90 bottom
SV12  54.61,14.61 0 top
SWD  54.61,1.9 0 top
TO_LCD  34.92,68.58 270 top
U1  57.15,33.66 180 top
U2  30.48,15.88 270 bottom
U3  83.82,38.73 270 top
U4  92.71,30.48 0 top
U5  26.67,69.22 270 bottom
U$1  [POLYU]  46.99,81.92 0 top
U$2  [EIE]  38.73,57.79 0 top
U$5  [70103]  97.15,31.12 90 bottom
U$6  [70103]  12.15,31.12 270 bottom
UART1  22.86,32.38 270 top
USB  29.21,20.95 0 top
V+  19.68,55.25 90 top
WIFI  69.85,46.36 180 top
X1  74.93,36.2 270 top

### Tracks (layer width: path | path; a pad name or v marks a point on that pad's centre or on a via)
+3V3  (via drill 0.7, 0.8, 1)  (1 unrouted)
  Top 0.254: U1.48 59.9,30.91 v59.69,31.12 | U1.9 59.71,34.91 v59.69,34.92 | U1.24 54.4,36.41 v54.61,36.2 | U1.36 54.4,30.91 v54.61,31.12
  Top 0.406: 90.75,33.66 U4.8 | 46.99,26.04 45.09,26.04 43.81,27.3 SV1.2 41.91,27.3 40.64,28.58 v40.64,29.84
  Top 1.016: v45.72,13.97 46.35,13.97 | C22.1 25.72,73.34 v25.4,73.66
  Top 1.27: v59.69,90.81 60.31,90.81 OK4.3
  Bottom 0.406: SV1.2 40.64,27.3 | U5.16 v25.4,73.66
  Bottom 0.813: U2.2 U2.4 31.09,12.68 | 45.09,13.97 44.45,14.61
  Bottom 1.016: C18.1 v89.53,33.66 | v45.72,13.97 45.09,13.97 | C2.1 60.01,35.24 v59.69,34.92 | v54.61,36.2 56.2,36.2 C1.1 | C21.1 54.92,30.8 v54.61,31.12 | C7.1 59.69,30.8 v59.69,31.12
  Bottom 1.27: 44.45,90.81 v59.69,90.81 62.23,90.81 81.28,71.75 81.28,69.22 | 44.45,90.81 43.18,92.08 43.18,94.61 | 55.37,105.28 51.56,109.09 OK1.3 46.23,109.09 43.69,106.55 OK1.1 | 55.37,105.28 55.37,100.2 60.96,94.61 OK4.3 | WIFI.3 v71.12,51.44 71.12,62.87 74.3,66.04 80.64,66.04 81.28,66.67 SV7.1 | 39.37,78.11 29.84,78.11 v25.4,73.66 | 39.37,78.11 44.45,83.19 44.45,90.81 | TO_LCD.2 37.47,72.39 39.37,74.3 39.37,78.11 | OK3.3 44.45,97.16 43.18,95.89 43.18,94.61 | OK3.1 43.18,94.61 | OK2.3 56.64,106.55 55.37,105.28
  Bottom 1.422: SWD.1 44.45,1.9 43.18,3.17 JTAG.2
  pour Top: 46.35,51.44 46.35,10.79 104.14,10.79 104.14,51.44 72.39,51.44 72.39,50.16 69.85,50.16 69.85,51.44
  pour Bottom: 5.16,51.44 5.16,10.79 38.1,10.79 38.1,1.9 45.09,1.9 45.09,51.44
+5V
  Bottom 0.813: SV11.4 21.59,60.33 21.59,59.69 22.23,59.05 22.23,56.52
  Bottom 1.27: V+.2 22.23,56.52 25.4,56.52 C23.+ | SV11.4 SV11.3 SV10.4 SV10.3 SV9.4 SV9.3 SV8.4 SV8.3
BOOT0
  Top 0.254: U1.44 57.9,24.02 58.42,23.49 SV2.5
  Bottom 1.016: SV2.5 58.42,23.81 R1.2
BOOT1
  Top 0.254: U1.20 56.4,43.3 55.88,43.82 SV4.8
  Bottom 1.016: R28.2 56.52,43.82 55.88,44.45 SV4.8
GND  (via drill 0.7, 0.8, 1)  (1 unrouted)
  Top 0.254: U1.47 59.4,28.92 v60.33,27.94 | U1.8 62.98,34.41 v63.5,34.92 | U1.23 54.9,38.45 v53.98,39.37 | U1.35 52.36,31.41 v51.44,30.48
  Top 0.305: U3.EXP 85.44,37.11 U3.21 85.44,34.57 v85.72,34.29 | U3.15 81.55,38.37 81.92,38.73
  Top 0.406: U4.4 95.83,27.88 v95.89,27.94
  Top 1.016: v85.72,34.29 87,34.29 87.31,33.98 C16.2 C14.2 | R15.1 93.66,41.27 | 93.66,41.27 R10.1 | v95.25,41.27 93.66,41.27 | v67.31,10.79 67.31,9.53
  Bottom 0.406: 80.64,38.73 C5.1 | GY521.2 44.45,46.36 46.99,46.36 | U5.5 28.57,68.58 v27.94,69.22 28.57,69.85 U5.4 | U5.8 v27.94,64.77
  Bottom 0.813: U2.1 25.07,19.07 USB.S1
  Bottom 1.016: C10.2 42.86,14.03 C13.-
  Bottom 1.27: SV7.2 83.82,66.04 81.92,64.14 74.93,64.14 73.66,62.87 v73.66,51.44
  Bottom 2.54: 80.64,38.73 87,38.73
  other vias: 20.32,51.44 22.86,51.44 53.34,51.44 55.88,51.44
  pour Bottom: 46.35,51.44 46.35,10.79 104.14,10.79 104.14,51.44
  pour Top: 5.16,51.44 5.16,10.79 38.1,10.79 38.1,0 71.12,0 71.12,9.53 45.09,9.53 45.09,51.44
  pour Top (isolate 0.406): 1.27,111.12 1.27,50.16 107.95,50.16 107.95,111.12
I2C2_SCL
  Top 0.254: U1.21 55.9,42.52 54.61,43.82 54.61,46.36 SV4.9
  Top 0.406: GY521.3 40.64,46.36 41.27,45.72 48.9,45.72 49.53,46.36 52.07,46.36 SV4.9
  Bottom 1.016: R13.1 40.64,45.41 GY521.3
I2C2_SDA
  Top 0.254: U1.22 55.4,41.76 53.34,43.82 SV4.10
  Top 0.406: SV4.12 39.37,45.09 38.1,46.36 GY521.4
  Top 1.422: SV4.12 SV4.10
  Bottom 1.016: R14.1 38.1,45.41 GY521.4
N$1
  Top 0.406: SV5.3 25.4,48.9 26.67,50.16 56.52,50.16 57.78,48.9 59.05,48.9 60.33,50.16 87.63,50.16 | 87.63,50.16 91.44,50.16 93.98,47.62 93.98,45.09 102.87,36.2 102.87,27.3 R20.1 | SV7.3 86.36,65.41 87.63,64.14 87.63,50.16
  Top 1.016: R26.2 OK3.4
  Bottom 1.27: SV6.4 92.71,20.95 93.34,21.59 97.16,21.59 R20.1 | 52.07,94.61 52.07,103.5 49.02,106.55 OK1.4 | 52.07,94.61 58.42,94.61 60.33,92.71 62.87,92.71 86.36,69.22 SV7.3 | OK3.4 52.07,94.61
N$2
  Bottom 1.016: USB.1 33.28,25.66 34.92,27.3 D1.A
N$3
  Top 1.422: J3.1 SV12.4
N$4
  Bottom 1.016: UART1.4 R11.1
N$5
  Top 0.254: U1.7 64.39,33.91 64.77,34.29 R3.2
N$6
  Bottom 1.27: OK3.2 35.65,102.23 | 35.65,102.23 35.65,107.4 37.34,109.09 OK1.2 | R25.1 35.65,102.23
N$7
  Top 1.016: R19.1 R18.1 R30.2
N$8
  Top 1.016: R23.1 R22.1 R31.2
N$9
  Bottom 1.422: PB14.2 20.32,22.23 19.05,20.95 LCD.1
N$10
  Bottom 1.27: OK4.1 73.65,107.33 71.88,109.09 OK2.1 63.23,102.23 R25.2
N$11
  Bottom 1.27: RESET.4 66.32,24.49 R3.1
N$12  (via drill 1)
  Top 1.016: R27.2 OK4.4
  Bottom 0.406: R16.1 97.79,19.69 102.87,24.77 102.87,36.2 93.98,45.09 93.98,47.62 90.17,51.44 v88.9,51.44
  Bottom 1.27: SV6.3 92.71,18.41 93.98,19.69 R16.1 | v88.9,51.44 SV7.4 88.9,69.22 67.31,90.81 67.31,96.2 R27.2 OK4.4 60.96,97.16 57.78,100.33 57.78,104.14 58.42,104.78 62.23,104.78 63.5,106.05 63.5,108.59 62.99,109.09 OK2.4
N$13
  Top 0.406: 71.75,12.06 71.12,12.06 71.12,12.32
  Top 1.422: J1.2 85.09,14.61 81.92,17.78 79.38,17.78 76.83,15.24 76.83,13.34 75.56,12.06 71.75,12.06 D2.A J3.2
N$14  (via drill 0.8)
  Top 0.406: v20.32,72.39 20.32,70.48 17.78,67.94 11.43,67.94 10.16,66.67 7.62,66.67 SV8.6
  Bottom 0.406: U5.15 v20.32,72.39
N$15  (via drill 1)  (7 unrouted)
  other vias: 35.56,51.44 38.1,51.44 40.64,51.44 43.18,51.44 45.72,51.44 48.26,51.44 50.8,51.44 68.58,51.44
N$16  (via drill 0.8)
  Top 0.406: v21.59,71.12 21.59,70.48 18.41,67.31 12.06,67.31 10.79,66.04 9.53,66.04 SV9.5
  Bottom 0.406: U5.14 v21.59,71.12
N$17
  Bottom 0.406: U5.13 20.32,69.85 17.78,67.31 13.34,67.31 SV9.6
N$18
  Bottom 0.406: U5.12 20.32,68.58 18.41,66.67 15.24,66.67 SV10.5
N$19
  Bottom 0.406: U5.11 20.32,67.31 19.05,66.04 17.14,66.04 SV10.6
N$20
  Top 0.406: U4.6 93.34,31.43 C19.1 95.25,31.12 97.79,33.66 R20.2
  Bottom 1.016: C19.1 95.25,31.12 97.79,33.66 R20.2
N$21
  Top 0.813: R5.1 46.99,19.25 S1.1
  Top 1.422: R2.2 R5.1
N$22
  Bottom 1.016: C10.1 40.96,19.73 S1.2
N$23
  Bottom 0.406: U5.10 20.32,66.04 18.41,64.14 SV11.5
N$24
  Bottom 0.406: U5.9 20.95,64.77 SV11.6
N$25
  Bottom 0.406: U5.7 27.3,66.04 24.77,63.5 22.23,63.5 21.59,62.87 3.81,62.87 SV8.5
N$27
  Top 1.016: C13.+ 41.02,12.95 43.18,10.79 61.59,10.79 D2.C
  Bottom 0.813: U2.3 32.79,18.64 33.02,18.41 38.1,18.41
  Bottom 1.27: D1.C 38.1,18.41 39.37,17.14 39.37,15.62 C13.+
N$31
  Top 1.27: R4.2 74.3,17.14 PB8.A
N$32
  Top 0.254: U1.17 57.9,39.48 R7.2
N$33
  Top 1.016: R35.1 52.64,16.57 53.34,15.88 SV12.2
N$37  (via drill 0.7)
  Top 0.305: U3.5 84.8,44.79 v85.09,45.09
  Bottom 0.305: R8.2 85.43,44.75 v85.09,45.09
N$42  (via drill 0.7)
  Top 0.305: U3.8 82.84,44.79 v82.55,45.09
  Bottom 0.305: R9.2 82.21,44.75 v82.55,45.09
N$43
  Top 0.305: U3.2 86.75,42.93 87,43.18 88.9,43.18 89.53,42.55 89.53,41.27 90.81,40.01 R10.2
N$46
  Top 0.305: U3.3 86.09,43.55 86.36,43.82 89.53,43.82 90.81,42.55 R15.2
N$47
  Top 0.305: U3.22 U3.23 U3.24
N$48
  Top 0.305: U3.17 82.84,34.59 82.55,34.29 81.92,34.29 80.97,33.34 C15.1
N$49
  Top 0.305: U3.20 84.8,33 C16.1
N$51  (via drill 0.7)
  Top 0.406: U4.5 94.61,35.24 R30.1
  Top 1.016: v96.52,34.92 95.56,35.88 R30.1
  Bottom 1.016: R17.2 95.25,36.2 v96.52,34.92
N$52
  Top 0.406: U4.2 92.08,29.21 92.71,29.84 R16.2
  Bottom 1.016: R16.2 94.93,29.84 C20.1
N$53  (via drill 0.7)
  Top 0.406: U4.3 R31.1
  Top 1.016: R31.1 94.93,25.08 v95.25,25.4
  Bottom 1.016: R21.2 94.61,26.04 v95.25,25.4
N$54
  Top 0.305: C15.2 83.5,33.02 U3.18 U3.19 84.14,30.17 R24.1
  Top 1.016: C14.1 R24.1 | C17.+ 81.53,29.46 82.86,30.8 C15.2
NRST
  Top 0.61: RESET.3 72.11,24.49 69.85,22.23 69.85,20.32 67.31,17.78 67.31,13.34 64.77,10.79 63.5,10.79 JTAG.15
  Top 1.016: R6.1 74.09,24.77 RESET.3
  Bottom 0.406: JTAG.15 59.69,6.98 59.69,4.45 58.42,3.17 SWD.5
  Bottom 1.016: R6.1 73.38,24.77 RESET.3
PA0
  Top 0.254: U1.10 62.08,35.41 64.14,37.47 SV3.10
  Top 0.305: U3.12 80.25,42.31 80.01,42.55 73.66,42.55 72.39,41.27 70.48,41.27 69.85,40.64 69.85,38.73 SV3.10
PA4  (via drill 1)
  Top 0.254: U1.14 59.4,39.08 60.33,40.01 61.59,40.01 64.77,43.18 64.77,45.72 63.5,46.99 SV4.1
  Top 1.016: R33.2 TO_LCD.4
  Bottom 0.406: U5.2 31.11,72.39 32.38,71.12 32.38,68.58 33.66,67.31 TO_LCD.4
  Bottom 1.016: TO_LCD.4 37.47,67.31 48.26,56.52 59.69,56.52 63.5,52.7 v63.5,51.44
  Bottom 1.27: SV4.1 v63.5,51.44
PA5
  Top 0.254: U1.15 58.9,39.22 60.33,40.64 61.59,40.64 63.5,42.55 SV4.2
PA8
  Top 0.254: U1.29 48.15,34.41 47.62,34.92 SV1.7
  Bottom 0.406: SV1.7 46.99,36.2 46.99,40.64 46.35,41.27 43.18,41.27 41.27,43.18 28.57,43.18 27.94,43.82 GY521.8
PA9
  Top 0.254: U1.30 46.6,33.91 46.35,33.66 44.45,33.66 SV1.8
  Bottom 0.406: SV1.8 33.66,34.92 29.84,31.12 27.3,31.12 24.77,33.66 UART1.2
  Bottom 1.27: LCD.6 19.05,33.66 19.68,33.02 20.95,33.02 21.59,33.66 UART1.2
PA10
  Top 0.254: U1.31 48.65,33.41 47.62,32.38 SV1.5
  Bottom 0.406: SV1.5 44.45,33.66 33.66,33.66 30.48,30.48 26.67,30.48 26.04,31.12 UART1.3
  Bottom 1.27: LCD.5 UART1.3
PA13  (via drill 0.8)
  Top 0.254: U1.34 50.95,31.91 46.35,27.3 SV1.1
  Top 0.406: JTAG.7 52.07,6.98 v54.61,6.98
  Bottom 0.254: SV1.1 45.72,15.88 50.8,10.79 JTAG.7
  Bottom 0.406: v54.61,6.98 54.61,4.45 55.88,3.17 SWD.4
PA14
  Top 0.254: U1.37 54.4,27.73 49.53,22.86 49.53,21.59 50.8,20.32 SV2.12
  Top 1.016: 50.48,19.37 SV2.12
  Bottom 0.406: 52.07,8.25 52.07,17.14 50.8,18.41 SV2.12 | 52.07,8.25 52.07,4.45 50.8,3.17 SWD.2 | JTAG.9 52.07,8.25
PA15  (via drill 0.8)
  Top 0.254: U1.38 54.9,26.96 50.8,22.86 SV2.11
  Top 0.406: v54.61,9.53 49.53,9.53 JTAG.5
  Bottom 0.406: SV2.11 52.07,20.95 52.07,19.05 54.61,16.51 v54.61,9.53
PB1
  Top 0.254: U1.19 56.9,44.2 57.15,44.45 57.15,46.36 SV4.7
PB3
  Top 0.254: U1.39 55.4,26.19 52.07,22.86 52.07,20.95 SV2.10
  Bottom 0.406: SV2.10 57.15,15.88 57.15,9.53 JTAG.13
PB4  (via drill 0.8)
  Top 0.254: U1.40 55.9,25.42 53.34,22.86 SV2.9
  Top 0.406: SV2.9 53.34,21.59 54.61,20.32 54.61,17.46 R35.2 54.61,17.33 54.61,13.34 53.34,12.06 v46.99,12.06
  Bottom 1.016: SV2.9 R36.2
  Bottom 1.422: JTAG.3 45.72,10.79 v46.99,12.06
PB5
  Top 0.254: U1.41 56.4,24.65 54.61,22.86 54.61,21.59 55.88,20.32 SV2.8
  Top 0.406: SV2.8 SV12.3
PB6
  Top 0.254: U1.42 56.9,23.88 55.88,22.86 SV2.7 55.88,21.59 57.15,20.32 57.15,18.41 R2.1
PB7  (via drill 0.8)
  Top 0.254: SV2.6 58.42,20.32 57.15,21.59 57.15,22.86 57.4,23.11 U1.43
  Top 0.406: U4.1 R22.2 90.81,25.4 89.53,26.67 73.03,26.67 72.39,26.04 71.12,26.04 v67.31,22.23
  Bottom 0.406: v67.31,22.23 66.04,22.23 64.77,20.95 59.69,20.95 SV2.6
PB8
  Top 0.254: SV2.4 59.69,20.95 59.69,24.77 58.4,26.05 U1.45
  Top 1.27: SV2.4 R4.1
PC13
  Top 0.254: U1.2 67.02,31.41 SV3.4
PC14
  Top 0.254: U1.3 67.16,31.91 67.94,31.12 69.22,31.12 70.48,29.84 SV3.3
  Top 0.305: U3.14 80.89,34.54 79.38,33.02 79.38,31.75 76.83,29.21 71.75,29.21 SV3.3
PC15
  Top 0.254: U1.4 68.56,32.41 SV3.6
  Top 0.305: U3.13 80.25,35.16 78.74,33.66 78.74,32.38 76.2,29.84 73.66,29.84 72.39,31.12 70.48,31.12 69.22,32.38 SV3.6
PD0
  Top 0.254: U1.5 65.92,32.91 66.67,33.66 69.85,33.66 SV3.7
  Bottom 1.016: X1.2 74.93,34.92 | C6.2 74.93,34.92 | SV3.7 74.93,34.92
PD1
  Top 0.254: U1.6 65.16,33.41 67.94,36.2 69.85,36.2 SV3.9
  Bottom 1.016: C5.2 76.07,37.47 X1.1 73.79,37.47 SV3.9
SPI2_MISO
  Top 0.254: U1.27 49.69,35.41 47.62,37.47 SV1.9
  Top 0.406: SPI2.8 13.97,32.38 18.41,32.38 20.32,34.29 PB14.1
  Bottom 0.406: SV1.9 44.45,36.2 32.38,36.2 29.84,38.73 27.3,38.73 24.77,36.2 24.77,35.56 24.13,34.92 PB14.1
SPI2_MOSI
  Top 0.254: U1.28 48.91,34.91 47.62,36.2 44.45,36.2 SV1.10
  Bottom 0.406: SV1.10 32.38,37.47 30.48,39.37 22.86,39.37 18.41,34.92 17.14,34.92 16.51,34.29 16.51,33.02 15.88,32.38 14.61,32.38 13.97,31.75 13.97,31.12 | LCD.4 17.14,28.58 15.88,29.84 14.61,29.84 13.97,30.48 13.97,31.12 | SPI2.6 13.97,31.12
SPI2_NSS
  Top 0.254: U1.25 51.23,36.41 47.62,40.01 SV1.11
  Bottom 0.406: SV1.11 44.45,38.73 32.38,38.73 31.11,40.01 22.23,40.01 18.41,36.2 LCD.7 17.14,36.2 15.88,34.92 14.61,34.92 13.34,36.2 SPI2.10
SPI2_SCK
  Top 0.254: U1.26 50.45,35.91 47.62,38.73 44.45,38.73 SV1.12
  Bottom 0.406: SV1.12 32.38,40.01 31.75,40.64 21.59,40.64 18.41,37.47 12.06,37.47 11.43,36.83 11.43,35.56 12.06,34.92 13.34,34.92 13.97,34.29 13.97,33.02 13.34,32.38 12.06,32.38 11.43,31.75 11.43,30.48 12.06,29.84 13.34,29.84 13.97,29.21 13.97,27.3 | 13.97,27.3 SPI2.2 | 13.97,27.3 16.51,27.3 LCD.3
TIM2_CH2
  Top 0.254: U1.11 61.94,35.91 64.77,38.73 J2.2
  Top 1.422: SV3.12 67.94,40.01 J2.2
TIM2_CH2A
  Top 0.406: R18.2 92.08,35.24 U4.7 92.08,31.12 91.44,30.48 90.17,30.48 89.53,29.84 89.53,27.94 88.9,27.3 78.74,27.3 77.47,28.58 J2.1
TIM3_CH1
  Top 0.254: SV4.3 62.23,46.36 62.23,41.91 61.59,41.27 60.33,41.27 58.4,39.35 U1.16
  Top 0.305: U3.10 81.55,43.55 80.64,44.45 76.2,44.45 74.3,46.36 65.41,46.36 64.77,46.99 64.77,48.26 64.14,48.9 62.23,48.9 SV4.3
TIM3_CH2
  Top 0.305: U3.11 80.89,42.93 80.01,43.82 73.66,43.82 72.39,42.55 R7.1
  Bottom 1.422: SV3.11 R7.1
TIM3_CH3  (via drill 0.8)
  Top 0.254: U1.18 57.4,39.62 59.69,41.91 59.69,43.82 SV4.4
  Top 1.016: v58.42,50.16 v58.42,52.7
  Bottom 0.406: SV4.4 59.69,46.36 59.69,48.9 v58.42,50.16 | v58.42,52.7 57.15,53.98 40.64,53.98 33.66,60.96 32.38,60.96 31.75,61.59 31.75,66.67 31.11,67.31 U5.6
TIM4_CH4
  Top 0.254: U1.46 58.9,26.83 SV2.1
U5A  (via drill 1)
  Top 1.016: R34.1 TO_LCD.1
  Bottom 0.406: U5.1 32.38,73.66 | TO_LCD.1 33.66,74.93 32.38,73.66 | 32.38,73.66 33.02,73.02 33.02,71.75 33.66,71.12 36.2,71.12 49.53,57.79 60.96,57.79 66.04,52.7 v66.04,51.44
U5C  (via drill 1)
  Top 1.016: R32.2 TO_LCD.6
  Bottom 0.406: U5.3 31.11,71.12 31.75,70.48 31.75,67.94 32.38,67.31 32.38,63.5 33.66,62.23 TO_LCD.6
  Bottom 1.016: TO_LCD.6 37.47,62.23 44.45,55.25 58.42,55.25 60.96,52.7 v60.96,51.44
USART2_RX  (via drill 0.8)
  Top 0.254: U1.13 59.9,38.95 60.33,39.37 61.59,39.37 63.5,41.27 v64.77,41.27
  Bottom 0.406: WIFI.1 73.03,47.62 71.75,46.36 65.41,46.36 64.77,45.72 v64.77,41.27
USART2_TX
  Top 0.254: WIFI.8 66.04,40.64 61.8,36.41 U1.12
USBDM
  Top 0.254: U1.32 49.41,32.91 47.62,31.12 45.09,31.12 43.81,29.84 SV1.4
  Bottom 0.406: SV1.4 42.55,29.84 41.27,28.58 40.01,28.58 39.37,29.21 34.29,29.21 33.02,27.94 28.57,27.94 27.96,27.33 USB.2
USBDP
  Top 0.254: U1.33 50.19,32.41 47.62,29.84 SV1.3
  Bottom 0.406: SV1.3 45.09,29.84 43.81,28.58 42.55,28.58 41.91,27.94 39.37,27.94 38.73,28.58 34.92,28.58 33.66,27.3 29.6,27.3 29.21,26.91 29.21,24.77 28.11,23.66 USB.3
  Bottom 1.016: R29.1 27.81,23.81 USB.3
V+
  Top 1.422: J1.3 85.09,17.14 83.82,18.41 R24.2
  Bottom 1.27: D3.C R24.2
X21
  Top 0.305: U3.9 82.19,44.1 MOTOR.4
X22
  Top 0.305: U3.7 83.5,46.3 MOTOR.3
X23
  Top 0.305: U3.6 84.14,46.3 MOTOR.2
X24
  Top 0.305: U3.4 85.44,44.1 MOTOR.1

### Text on the board
tPlace: ENSYLAM 110 x 111.125 | B | A